# EAGLE design v1 (EAGLE 7.5.0)
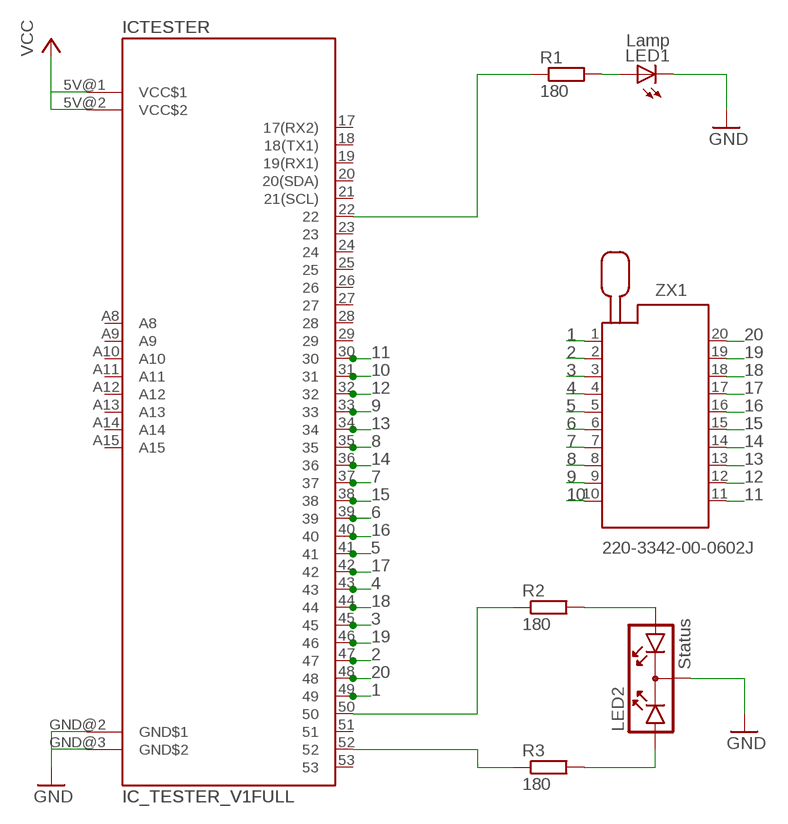
[diagram p0: schematic, sheet 1]

## Parts
ICTESTER  IC_TESTER_V1FULL  [SPARKFUN-BOARDS_ARDUINO_MEGA]
LED1  Lamp  LED3MM  [LED3MM]
LED2  Status  DUOLED  [DUOLED]
R1  180  R-EU_0204/2V  [0204V]
R2  180  R-EU_0204/2V  [0204V]
R3  180  R-EU_0204/2V  [0204V]
ZX1  220-3342-00-0602J  [220-3342-00-0602J]

## Nets
1: ICTESTER.49 ZX1.1
2: ICTESTER.47 ZX1.2
3: ICTESTER.45 ZX1.3
4: ICTESTER.43 ZX1.4
5: ICTESTER.41 ZX1.5
6: ICTESTER.39 ZX1.6
7: ICTESTER.37 ZX1.7
8: ICTESTER.35 ZX1.8
9: ICTESTER.33 ZX1.9
10: ICTESTER.31 ZX1.10
11: ICTESTER.30 ZX1.11
12: ICTESTER.32 ZX1.12
13: ICTESTER.34 ZX1.13
14: ICTESTER.36 ZX1.14
15: ICTESTER.38 ZX1.15
16: ICTESTER.40 ZX1.16
17: ICTESTER.42 ZX1.17
18: ICTESTER.44 ZX1.18
19: ICTESTER.46 ZX1.19
20: ICTESTER.48 ZX1.20
GND: ICTESTER.GND@2(GND$1) ICTESTER.GND@3(GND$2) LED1.K(C) LED2.K
N$1: LED1.A R1.2
N$2: LED2.A2 R2.2
N$3: LED2.A1 R3.2
N$4: ICTESTER.50 R2.1
N$5: ICTESTER.52 R3.1
N$6: ICTESTER.22 R1.1
VCC: ICTESTER.5V@1(VCC$1) ICTESTER.5V@2(VCC$2)
Unconnected: ICTESTER.17(17(RX2)) ICTESTER.18(18(TX1)) ICTESTER.19(19(RX1)) ICTESTER.20(20(SDA)) ICTESTER.21(21(SCL)) ICTESTER.23 ICTESTER.24 ICTESTER.25 ICTESTER.26 ICTESTER.27 ICTESTER.28 ICTESTER.29 ICTESTER.51 ICTESTER.53 ICTESTER.A8 ICTESTER.A9 ICTESTER.A10 ICTESTER.A11 ICTESTER.A12 ICTESTER.A13 ICTESTER.A14 ICTESTER.A15

## Library data of the parts
ICTESTER = ICTester_v1:IC_TESTER_V1: Arduino Mega R3 ATmega2560 R3 compatible footprint. SparkFun Products: Arduino Mega 2560 R3 <https://www.sparkfun.com/products/11061>
LED1 = adafruit:LED: LED OSRAM: - CHIPLED LG R971, LG N971, LY N971, LG Q971, LY Q971, LO R971, LY R971 LH N974, LH R974 LS Q976, LO Q976, LY Q976 LO Q996 - Hyper CHIPLED LW Q18S LB Q993, LB Q99A, LB R99A - SideLED LS A670, LO A670, LY A670, LG A670, LP A670 LB A673, LV A673, LT A673, LW A673 LH A674 LY A675 LS A676, LA A676, LO A676, LY A676, LW A676 LS A679, LY A679, LG A679 - Hyper Micro SIDELED® LS Y876, LA Y876, LO Y876, LY Y876 LT Y87S - SmartLED LW L88C, LW L88S LB L89C, LB L89S, LG L890 LS L89K, LO L89K, LY L89K LS L896, LA L896, LO L896, LY L896 - TOPLED LS T670, LO T670, LY T670, LG T670, LP T670 LSG T670, LSP T670, LSY T670, LOP T670, LYG T670 LG T671, LOG T671, LSG T671 LB T673, LV T673, LT T673, LW T673 LH T674 LS T676, LA T676, LO T676, LY T676, LB T676, LH T676, LSB T676, LW T676 LB T67C, LV T67C, LT T67C, LS T67K, LO T67K, LY T67K, LW E67C LS E67B, LA E67B, LO E67B, LY E67B, LB E67C, LV E67C, LT E67C LW T67C LS T679, LY T679, LG T679 LS T770, LO T770, LY T770, LG T770, LP T770 LB T773, LV T773, LT T773, LW T773 LH T774 LS E675, LA E675, LY E675, LS T675 LS T776, LA T776, LO T776, LY T776, LB T776 LHGB T686 LT T68C, LB T68C - Hyper Mini TOPLED® LB M676 - Mini TOPLED Santana® LG M470 LS M47K, LO M47K, LY M47K Source: http://www.osram.convergy.de/
LED2 = special:DUOLED: Duo LED
R1-R3 = rcl:R-EU_: RESISTOR, European symbol
ZX1 = con-3m:220-3342-00-0602J: Zero Insertion Force Socked Source: http://www.3M.com/ehpd; MF: 3M; MPN: 220-3342-00-0602J; OC_FARNELL: 9897445; OC_NEWARK: 85K7807

## Board
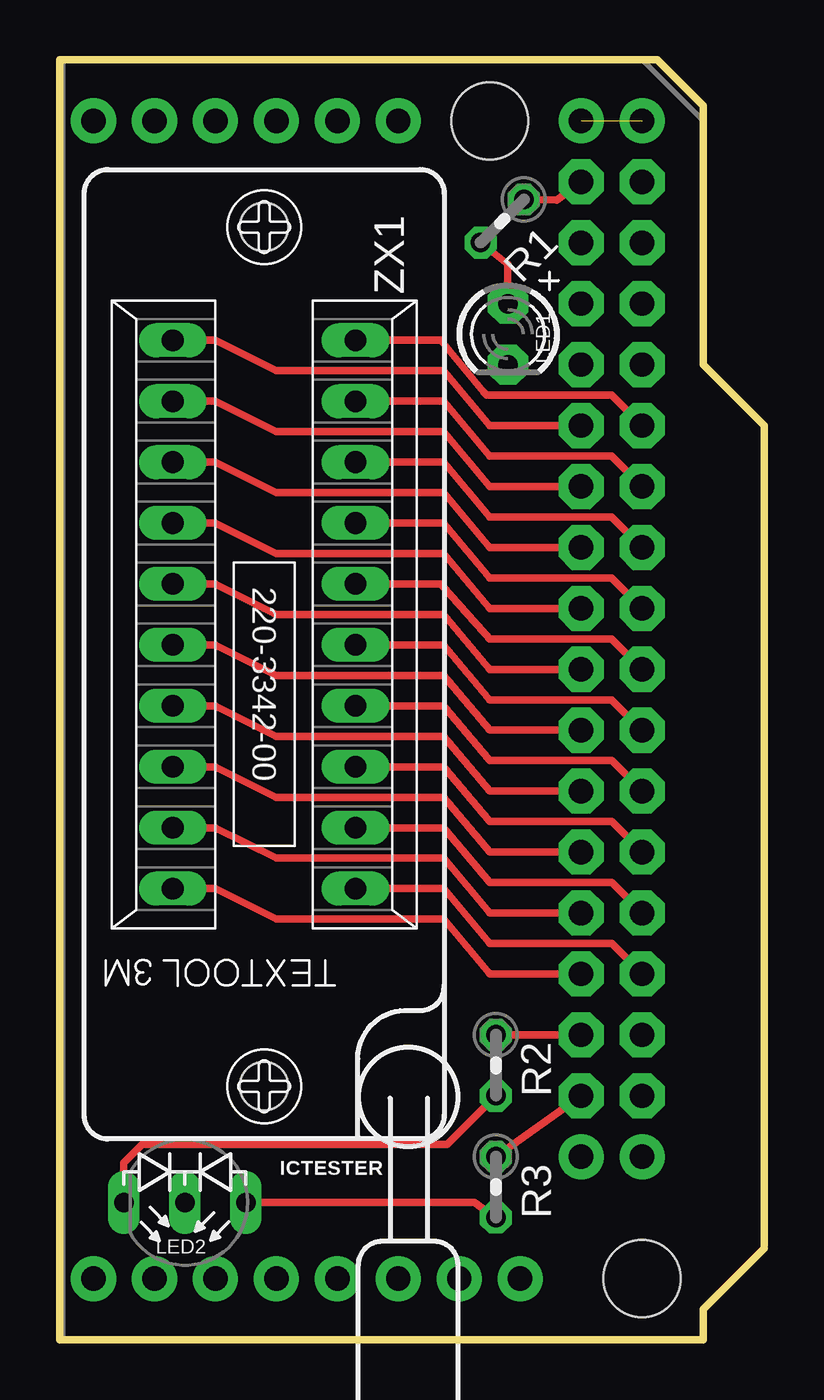
[diagram p1: board, top side]
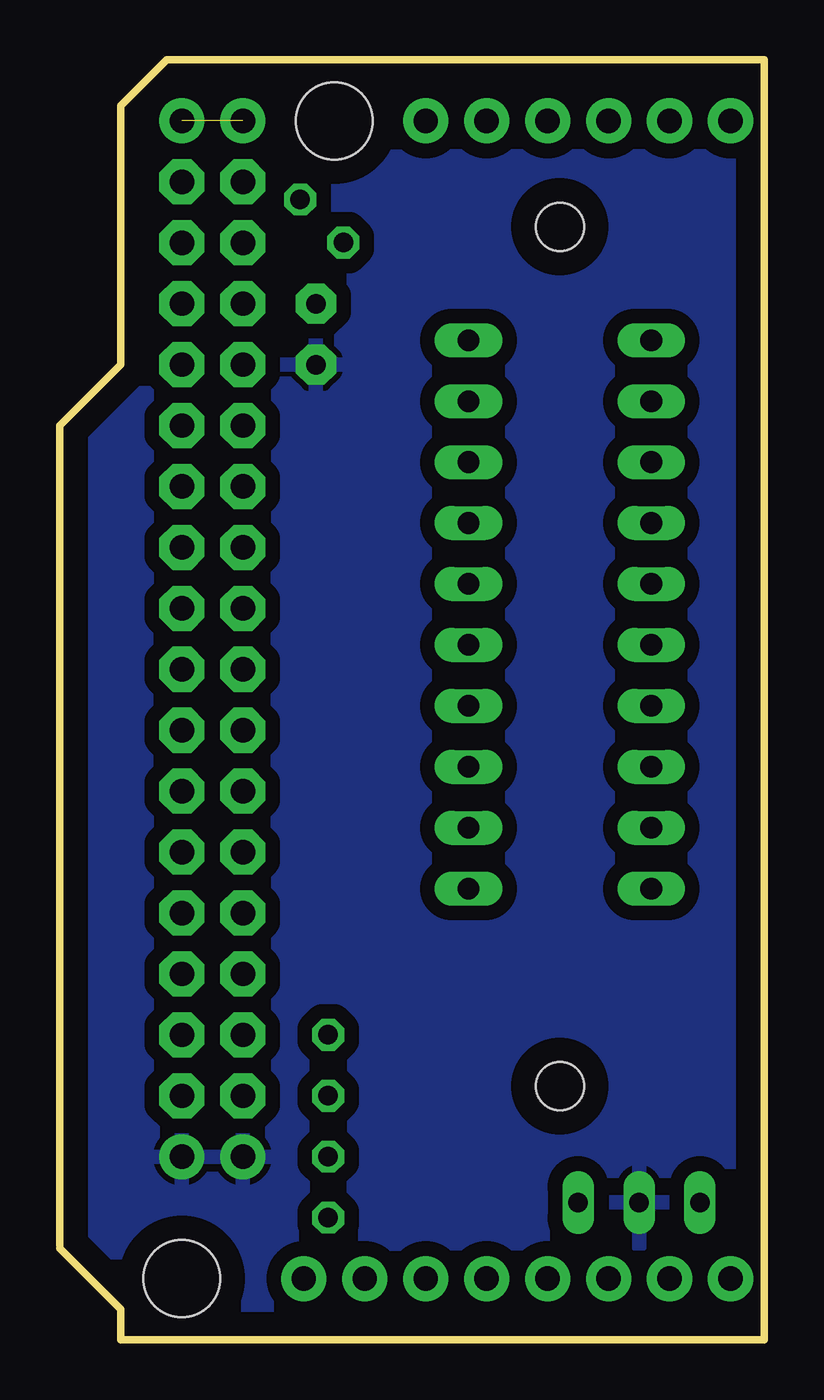
[diagram p2: board, bottom side, seen from below]

Size 29.34 x 53.34 mm. Coordinates in mm from the lower left corner, seen from the top.
Outline: 29.32,3.79 29.34,3.81 26.8,1.27 26.8,0 0,0 0,53.34 24.89,53.34 26.8,51.44 26.8,40.64 29.34,38.1 29.34,3.94
Copper layers (1*16): Top 0.035mm / dielectric 1.5mm / Bottom 0.035mm
Design rules "default *": minimum track width 6mil, minimum drill 0.35mm, track to track 6mil, track to pad 6mil, pad to pad 6mil, via to via 6mil, smd to smd 6mil, copper to edge 40mil, drill to drill 6mil, minimum pad ring 10mil, minimum via ring 8mil, stop-mask expansion 4mil, vias tented up to drill 0.3500125mm, thermal gap 10mil

### Footprints (pad centres in the part's own frame; a part is rotated, then mirrored left to right if it is on the bottom)
SPARKFUN-BOARDS_ARDUINO_MEGA = drill 1.016 pad 1.88: 5V@1 44.45,24.13; 5V@2 46.99,24.13; 16 24.13,24.13; 17 26.67,24.13; 18 29.21,24.13; 19 31.75,24.13; 20 34.29,24.13; 21 36.83,24.13; A8 24.13,-24.13; A9 26.67,-24.13; A10 29.21,-24.13; A11 31.75,-24.13; A12 34.29,-24.13; A13 36.83,-24.13; A14 39.37,-24.13; A15 41.91,-24.13; GND@2 44.45,-19.05; GND@3 46.99,-19.05 | drill 1.016 pad 1.88 octagon: 22 44.45,21.59; 23 46.99,21.59; 24 44.45,19.05; 25 46.99,19.05; 26 44.45,16.51; 27 46.99,16.51; 28 44.45,13.97; 29 46.99,13.97; 30 44.45,11.43; 31 46.99,11.43; 32 44.45,8.89; 33 46.99,8.89; 34 44.45,6.35; 35 46.99,6.35; 36 44.45,3.81; 37 46.99,3.81; 38 44.45,1.27; 39 46.99,1.27; 40 44.45,-1.27; 41 46.99,-1.27; 42 44.45,-3.81; 43 46.99,-3.81; 44 44.45,-6.35; 45 46.99,-6.35; 46 44.45,-8.89; 47 46.99,-8.89; 48 44.45,-11.43; 49 46.99,-11.43; 50 44.45,-13.97; 51 46.99,-13.97; 52 44.45,-16.51; 53 46.99,-16.51 | hole 3.2: 40.64,24.13; 46.99,-24.13
LED3MM = drill 0.813 pad 1.676 octagon: A -1.27,0; K 1.27,0
DUOLED = drill 0.813 long: A1 -3.81,0; A2 1.27,0; K -1.27,0
0204V = drill 0.813 octagon: 1 -1.27,0; 2 1.27,0
220-3342-00-0602J = drill 0.9 long: 1 -11.43,-3.81; 2 -8.89,-3.81; 3 -6.35,-3.81; 4 -3.81,-3.81; 5 -1.27,-3.81; 6 1.27,-3.81; 7 3.81,-3.81; 8 6.35,-3.81; 9 8.89,-3.81; 10 11.43,-3.81; 11 11.43,3.81; 12 8.89,3.81; 13 6.35,3.81; 14 3.81,3.81; 15 1.27,3.81; 16 -1.27,3.81; 17 -3.81,3.81; 18 -6.35,3.81; 19 -8.89,3.81; 20 -11.43,3.81 | hole 2: 16.16,0; -19.66,0

### Placement (x,y rotation side)
ICTESTER  -22.73,26.67 0 top
LED1  18.67,41.91 270 top
LED2  3.94,5.71 180 top
R1  18.43,46.62 225 top
R2  18.16,11.43 270 top
R3  18.16,6.35 270 top
ZX1  8.51,30.23 90 top

### Tracks (layer width: path | path; a pad name or v marks a point on that pad's centre or on a via)
1
  Top 0.305: ZX1.1 16,18.8 17.91,16.51 22.99,16.51 ICTESTER.49
2
  Top 0.305: ZX1.2 16,21.34 17.91,19.05 22.99,19.05 ICTESTER.47
3
  Top 0.305: ZX1.3 16,23.88 17.91,21.59 22.99,21.59 ICTESTER.45
4
  Top 0.305: ZX1.4 16,26.42 17.91,24.13 22.99,24.13 ICTESTER.43
5
  Top 0.305: ZX1.5 16,28.96 17.91,26.67 22.99,26.67 ICTESTER.41
6
  Top 0.305: ZX1.6 15.88,31.5 17.91,29.21 22.99,29.21 ICTESTER.39
7
  Top 0.305: ZX1.7 16,34.04 17.91,31.75 22.99,31.75 ICTESTER.37
8
  Top 0.305: ZX1.8 16,36.58 17.91,34.29 22.99,34.29 ICTESTER.35
9
  Top 0.305: ZX1.9 16,39.12 17.91,36.83 22.99,36.83 ICTESTER.33
10
  Top 0.305: ZX1.10 15.88,41.66 17.65,39.5 17.78,39.37 22.99,39.37 ICTESTER.31
11
  Top 0.305: ZX1.11 6.48,41.66 9.02,40.39 16,40.39 17.91,38.1 ICTESTER.30
12
  Top 0.305: ZX1.12 6.48,39.12 9.02,37.85 16,37.85 17.91,35.56 ICTESTER.32
13
  Top 0.305: ZX1.13 6.48,36.58 9.02,35.31 16,35.31 17.91,33.02 ICTESTER.34
14
  Top 0.305: ZX1.14 6.48,34.04 9.02,32.77 16,32.77 17.91,30.48 ICTESTER.36
15
  Top 0.305: ZX1.15 6.48,31.5 9.02,30.23 16,30.23 17.91,27.94 ICTESTER.38
16
  Top 0.305: ZX1.16 6.48,28.96 9.02,27.69 16,27.69 17.91,25.4 ICTESTER.40
17
  Top 0.305: ZX1.17 6.48,26.42 9.02,25.15 16,25.15 17.91,22.86 ICTESTER.42
18
  Top 0.305: ZX1.18 6.48,23.88 9.02,22.61 16,22.61 17.91,20.32 ICTESTER.44
19
  Top 0.305: ZX1.19 6.48,21.34 9.02,20.07 16,20.07 17.91,17.78 ICTESTER.46
20
  Top 0.305: ZX1.20 6.48,18.8 9.02,17.53 16,17.53 17.91,15.24 ICTESTER.48
GND
  pour Bottom (isolate 0.61): 0.13,53.34 24.89,53.34 26.8,51.44 26.8,40.64 29.34,38.1 29.34,3.81 26.8,1.27 26.8,0 0.13,0
N$1
  Top 0.305: R1.2 18.67,44.83 LED1.A
N$2
  Top 0.305: LED2.A2 2.67,7.37 3.43,8.13 16.13,8.13 R2.2
N$3
  Top 0.305: LED2.A1 17.27,5.71 R3.2
N$4
  Top 0.305: ICTESTER.50 R2.1
N$5
  Top 0.305: ICTESTER.52 R3.1
N$6
  Top 0.305: ICTESTER.22 20.7,47.5 R1.1
VCC  (1 unrouted)

### Text on the board
tSilk: 1 | 1 | U | IC Tester 1.0 by F. Hellmann